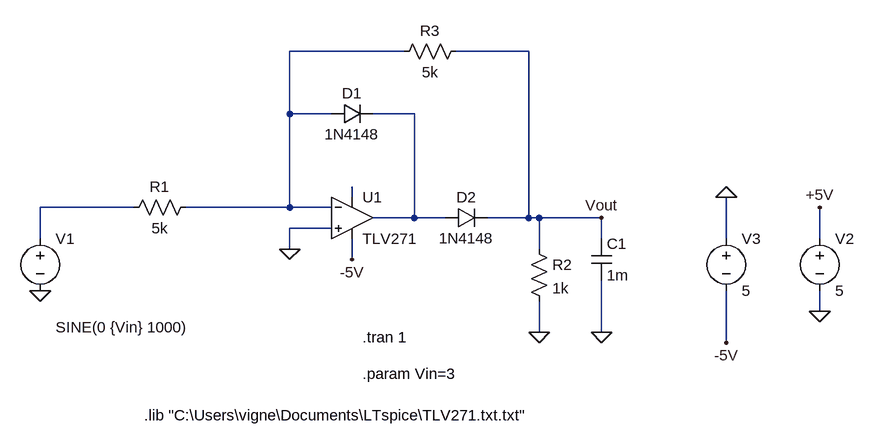
[diagram p0: schematic PrecisionRectifier.asc]
PrecisionRectifier.asc, the LTspice schematic file:
Version 4.1
SHEET 1 936 680
WIRE 240 -64 64 -64
WIRE 432 -64 320 -64
WIRE 64 32 64 -64
WIRE 128 32 64 32
WIRE 256 32 192 32
WIRE 160 160 160 144
WIRE -176 176 -320 176
WIRE 64 176 64 32
WIRE 64 176 -96 176
WIRE 128 176 64 176
WIRE 256 192 256 32
WIRE 256 192 192 192
WIRE 304 192 256 192
WIRE 432 192 432 -64
WIRE 432 192 368 192
WIRE 448 192 432 192
WIRE 544 192 448 192
WIRE 128 208 64 208
WIRE -320 224 -320 176
WIRE 544 224 544 192
WIRE 736 224 736 160
WIRE 880 224 880 176
WIRE 64 240 64 208
WIRE 448 240 448 192
WIRE 160 256 160 224
WIRE 880 336 880 304
WIRE 448 368 448 320
WIRE 544 368 544 288
WIRE 736 384 736 304
FLAG 64 240 0
FLAG 160 256 -5V
FLAG -320 304 0
FLAG 880 336 0
FLAG 880 176 +5V
FLAG 448 368 0
FLAG 544 368 0
FLAG 736 160 0
FLAG 736 384 -5V
FLAG 544 192 Vout
SYMBOL OpAmps\\opamp2 160 128 R0
SYMATTR InstName U1
SYMATTR Value TLV271
SYMBOL diode 128 48 R270
WINDOW 0 32 32 VTop 2
WINDOW 3 0 32 VBottom 2
SYMATTR InstName D1
SYMATTR Value 1N4148
SYMBOL res -80 160 R90
WINDOW 0 0 56 VBottom 2
WINDOW 3 32 56 VTop 2
SYMATTR InstName R1
SYMATTR Value 5k
SYMBOL voltage -320 208 R0
WINDOW 3 24 152 Left 2
WINDOW 123 24 124 Left 2
WINDOW 39 0 0 Left 0
SYMATTR InstName V1
SYMATTR Value SINE(0 {Vin} 1000)
SYMBOL voltage 880 208 R0
WINDOW 123 0 0 Left 0
WINDOW 39 0 0 Left 0
SYMATTR InstName V2
SYMATTR Value 5
SYMBOL diode 304 208 R270
WINDOW 0 32 32 VTop 2
WINDOW 3 0 32 VBottom 2
SYMATTR InstName D2
SYMATTR Value 1N4148
SYMBOL res 432 224 R0
SYMATTR InstName R2
SYMATTR Value 1k
SYMBOL res 336 -80 R90
WINDOW 0 0 56 VBottom 2
WINDOW 3 32 56 VTop 2
SYMATTR InstName R3
SYMATTR Value 5k
SYMBOL cap 528 224 R0
SYMATTR InstName C1
SYMATTR Value 1m
SYMBOL voltage 736 208 R0
WINDOW 123 0 0 Left 0
WINDOW 39 0 0 Left 0
SYMATTR InstName V3
SYMATTR Value 5
TEXT -160 496 Left 2 !.lib "C:\\Users\\vigne\\Documents\\LTspice\\TLV271.txt.txt"
TEXT 176 376 Left 2 !.tran 1
TEXT 176 432 Left 2 !.param Vin=3

The netlist it stands for:
* PrecisionRectifier.asc
X§U1 0 N001 N003 -5V N002 TLV271  ; pins In+ In- V+ V- OUT
D1 N001 N002 1N4148
R1 N001 N004 5k
V1 N004 0 SINE(0 {Vin} 1000)
V2 +5V 0 5
D2 N002 Vout 1N4148
R2 Vout 0 1k
R3 Vout N001 5k
C1 Vout 0 1m
V3 0 -5V 5
.model D D
.lib standard.dio
.lib "C:\Users\vigne\Documents\LTspice\TLV271.txt.txt"
.tran 1
.param Vin=3
.backanno
.end